# Altium schematic sheet Sheet4.SchDoc
size A4; SheetNumber: 1; SheetTotal: 3
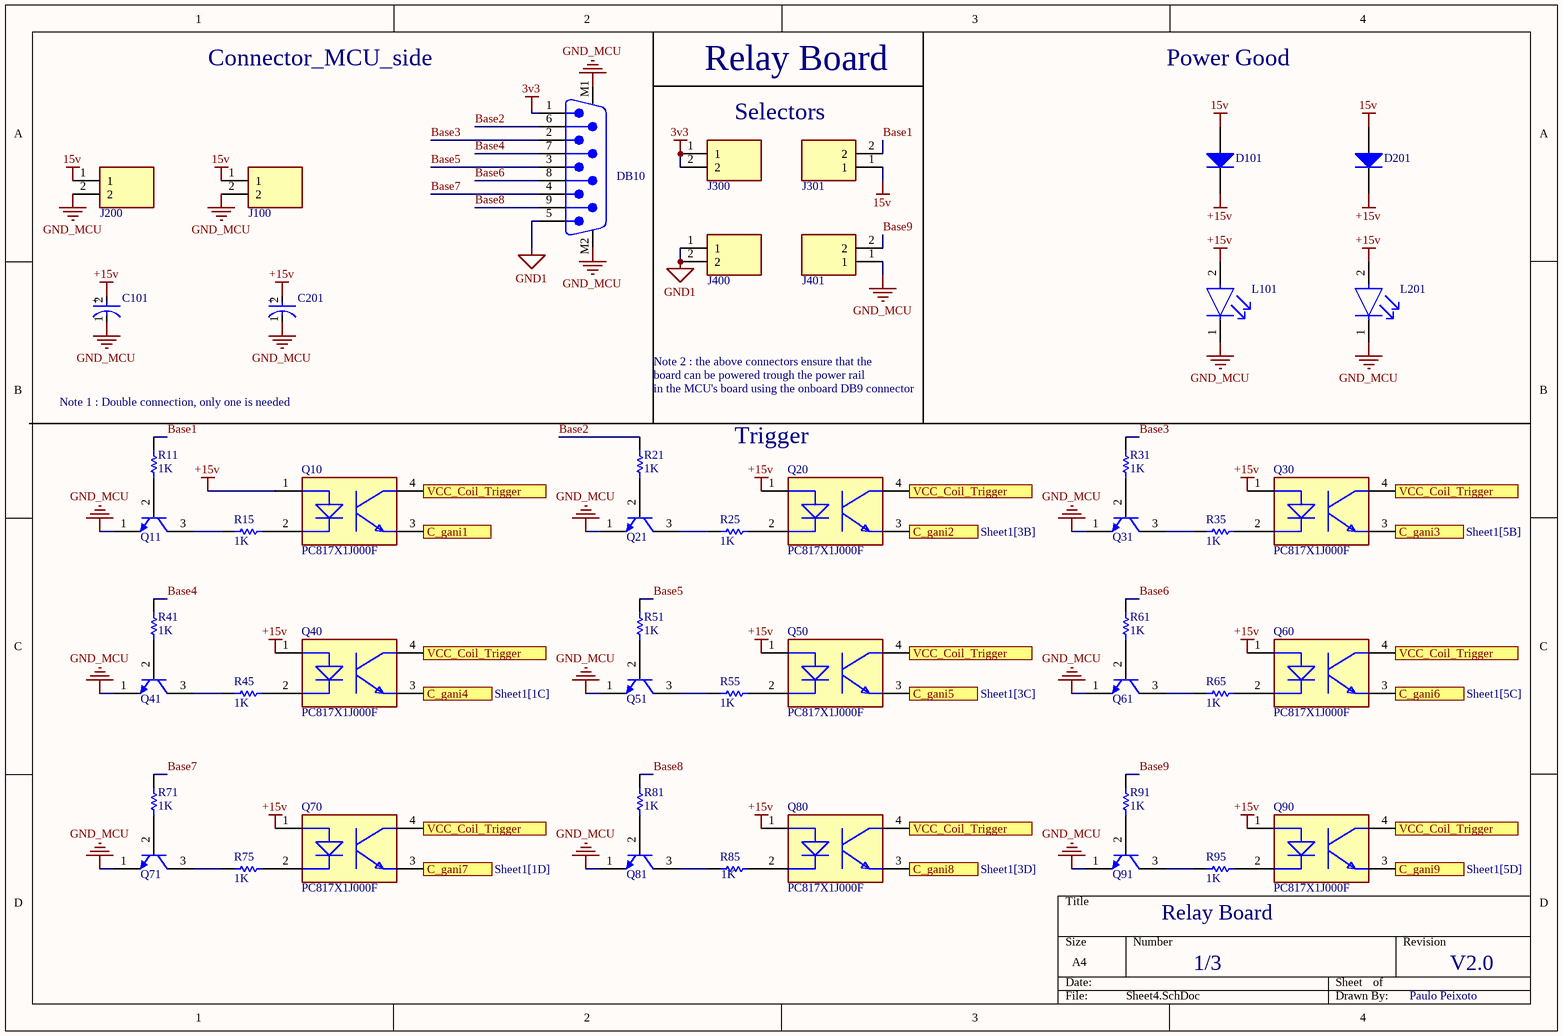
[diagram p0: Sheet4.SchDoc]

## Parts
C101  EEE-FK1H100UR  [FP-FKC-MFG]  (value not drawn)
C201  EEE-FK1H100UR  [FP-FKC-MFG]  (value not drawn)
D101  1N4001-T  [DIOD-DO-41-P-2_V]  (value not drawn)
D201  1N4001-T  [DIOD-DO-41-P-2_V]  (value not drawn)
DB10  618009231221  [618009231221]  (value not drawn)
J100  TB004-508-02BE  [Terminal_TH_2P_3.50]  (value not drawn)
J200  TB004-508-02BE  [Terminal_TH_2P_3.50]  (value not drawn)
J300  TB004-508-02BE  [HEADER_MALE_TH_2P_2.54]  (value not drawn)
J301  TB004-508-02BE  [HEADER_MALE_TH_2P_2.54]  (value not drawn)
J400  TB004-508-02BE  [HEADER_MALE_TH_2P_2.54]  (value not drawn)
J401  TB004-508-02BE  [HEADER_MALE_TH_2P_2.54]  (value not drawn)
L101  TLLG4400  [FP-6_544-5255_01-4-MFG]  (value not drawn)
L201  TLLG4400  [FP-6_544-5255_01-4-MFG]  (value not drawn)
Q10  PC817X1J000F  [FP-PC817X1J000F-MFG]
Q11  PN2222ATF  [FAIR-TO-92-3]  (value not drawn)
Q20  PC817X1J000F  [FP-PC817X1J000F-MFG]
Q21  PN2222ATF  [FAIR-TO-92-3]  (value not drawn)
Q30  PC817X1J000F  [FP-PC817X1J000F-MFG]
Q31  PN2222ATF  [FAIR-TO-92-3]  (value not drawn)
Q40  PC817X1J000F  [FP-PC817X1J000F-MFG]
Q41  PN2222ATF  [FAIR-TO-92-3]  (value not drawn)
Q50  PC817X1J000F  [FP-PC817X1J000F-MFG]
Q51  PN2222ATF  [FAIR-TO-92-3]  (value not drawn)
Q60  PC817X1J000F  [FP-PC817X1J000F-MFG]
Q61  PN2222ATF  [FAIR-TO-92-3]  (value not drawn)
Q70  PC817X1J000F  [FP-PC817X1J000F-MFG]
Q71  PN2222ATF  [FAIR-TO-92-3]  (value not drawn)
Q80  PC817X1J000F  [FP-PC817X1J000F-MFG]
Q81  PN2222ATF  [FAIR-TO-92-3]  (value not drawn)
Q90  PC817X1J000F  [FP-PC817X1J000F-MFG]
Q91  PN2222ATF  [FAIR-TO-92-3]  (value not drawn)
R11  1K  [RESC3216X70X50NL05T20]
R15  1K  [RESC3216X70X50NL05T20]
R21  1K  [RESC3216X70X50NL05T20]
R25  1K  [RESC3216X70X50NL05T20]
R31  1K  [RESC3216X70X50NL05T20]
R35  1K  [RESC3216X70X50NL05T20]
R41  1K  [RESC3216X70X50NL05T20]
R45  1K  [RESC3216X70X50NL05T20]
R51  1K  [RESC3216X70X50NL05T20]
R55  1K  [RESC3216X70X50NL05T20]
R61  1K  [RESC3216X70X50NL05T20]
R65  1K  [RESC3216X70X50NL05T20]
R71  1K  [RESC3216X70X50NL05T20]
R75  1K  [RESC3216X70X50NL05T20]
R81  1K  [RESC3216X70X50NL05T20]
R85  1K  [RESC3216X70X50NL05T20]
R91  1K  [RESC3216X70X50NL05T20]
R95  1K  [RESC3216X70X50NL05T20]

## Ports
C_gani1 (see Sheet1[1B]), C_gani2 (see Sheet1[3B]), C_gani3 (see Sheet1[5B]), C_gani4 (see Sheet1[1C]), C_gani5 (see Sheet1[3C]), C_gani6 (see Sheet1[5C]), C_gani7 (see Sheet1[1D]), C_gani8 (see Sheet1[3D]), C_gani9 (see Sheet1[5D]), VCC_Coil_Trigger (see Sheet1[1A], Sheet1[1C], Sheet1[1D], Sheet1[3A], Sheet1[3C], Sheet1[3D], Sheet1[5A], Sheet1[5C], Sheet1[5D], Sheet2[1A], Sheet2[2A], Sheet4[2B], Sheet4[2C], Sheet4[2D], Sheet4[3B], Sheet4[3C], Sheet4[3D], Sheet4[4B], Sheet4[4C]), VCC_Coil_Trigger (see Sheet1[1A], Sheet1[1C], Sheet1[1D], Sheet1[3A], Sheet1[3C], Sheet1[3D], Sheet1[5A], Sheet1[5C], Sheet1[5D], Sheet2[1A], Sheet2[2A], Sheet4[2B], Sheet4[2C], Sheet4[2D], Sheet4[3B], Sheet4[3C], Sheet4[3D], Sheet4[4B], Sheet4[4D]), VCC_Coil_Trigger (see Sheet1[1A], Sheet1[1C], Sheet1[1D], Sheet1[3A], Sheet1[3C], Sheet1[3D], Sheet1[5A], Sheet1[5C], Sheet1[5D], Sheet2[1A], Sheet2[2A], Sheet4[2B], Sheet4[2C], Sheet4[2D], Sheet4[3B], Sheet4[3C], Sheet4[3D], Sheet4[4C], Sheet4[4D]), VCC_Coil_Trigger (see Sheet1[1A], Sheet1[1C], Sheet1[1D], Sheet1[3A], Sheet1[3C], Sheet1[3D], Sheet1[5A], Sheet1[5C], Sheet1[5D], Sheet2[1A], Sheet2[2A], Sheet4[2B], Sheet4[2C], Sheet4[2D], Sheet4[3B], Sheet4[3C], Sheet4[4B], Sheet4[4C], Sheet4[4D]), VCC_Coil_Trigger (see Sheet1[1A], Sheet1[1C], Sheet1[1D], Sheet1[3A], Sheet1[3C], Sheet1[3D], Sheet1[5A], Sheet1[5C], Sheet1[5D], Sheet2[1A], Sheet2[2A], Sheet4[2B], Sheet4[2C], Sheet4[2D], Sheet4[3B], Sheet4[3D], Sheet4[4B], Sheet4[4C], Sheet4[4D]), VCC_Coil_Trigger (see Sheet1[1A], Sheet1[1C], Sheet1[1D], Sheet1[3A], Sheet1[3C], Sheet1[3D], Sheet1[5A], Sheet1[5C], Sheet1[5D], Sheet2[1A], Sheet2[2A], Sheet4[2B], Sheet4[2C], Sheet4[2D], Sheet4[3C], Sheet4[3D], Sheet4[4B], Sheet4[4C], Sheet4[4D]), VCC_Coil_Trigger (see Sheet1[1A], Sheet1[1C], Sheet1[1D], Sheet1[3A], Sheet1[3C], Sheet1[3D], Sheet1[5A], Sheet1[5C], Sheet1[5D], Sheet2[1A], Sheet2[2A], Sheet4[2B], Sheet4[2C], Sheet4[3B], Sheet4[3C], Sheet4[3D], Sheet4[4B], Sheet4[4C], Sheet4[4D]), VCC_Coil_Trigger (see Sheet1[1A], Sheet1[1C], Sheet1[1D], Sheet1[3A], Sheet1[3C], Sheet1[3D], Sheet1[5A], Sheet1[5C], Sheet1[5D], Sheet2[1A], Sheet2[2A], Sheet4[2B], Sheet4[2D], Sheet4[3B], Sheet4[3C], Sheet4[3D], Sheet4[4B], Sheet4[4C], Sheet4[4D]), VCC_Coil_Trigger (see Sheet1[1A], Sheet1[1C], Sheet1[1D], Sheet1[3A], Sheet1[3C], Sheet1[3D], Sheet1[5A], Sheet1[5C], Sheet1[5D], Sheet2[1A], Sheet2[2A], Sheet4[2C], Sheet4[2D], Sheet4[3B], Sheet4[3C], Sheet4[3D], Sheet4[4B], Sheet4[4C], Sheet4[4D])

## Nets
3v3: DB10.1 J300.1 J300.2
15v: D101.1(A) D201.1(A) J100.1 J200.1 J301.1
+15v: C101.2(A) C201.2(A) D101.2(K) D201.2(K) L101.2(A) L201.2(A) Q10.1(A) Q20.1(A) Q30.1(A) Q40.1(A) Q50.1(A) Q60.1(A) Q70.1(A) Q80.1(A) Q90.1(A)
GND1: DB10.5 J400.1 J400.2
GND_MCU: C101.1(C) C201.1(C) DB10.M1 DB10.M2 J100.2 J200.2 J401.1 L101.1(C) L201.1(C) Q11.1(E) Q21.1(E) Q31.1(E) Q41.1(E) Q51.1(E) Q61.1(E) Q71.1(E) Q81.1(E) Q91.1(E)
Base1: J301.2 R11.2
Base2: DB10.6 R21.2
Base3: DB10.2 R31.2
Base4: DB10.7 R41.2
Base5: DB10.3 R51.2
Base6: DB10.8 R61.2
Base7: DB10.4 R71.2
Base8: DB10.9 R81.2
Base9: J401.2 R91.2
C_gani1: Q10.3(E) ; port C_gani1
C_gani2: Q20.3(E) ; port C_gani2
C_gani3: Q30.3(E) ; port C_gani3
C_gani4: Q40.3(E) ; port C_gani4
C_gani5: Q50.3(E) ; port C_gani5
C_gani6: Q60.3(E) ; port C_gani6
C_gani7: Q70.3(E) ; port C_gani7
C_gani8: Q80.3(E) ; port C_gani8
C_gani9: Q90.3(E) ; port C_gani9
VCC_Coil_Trigger: Q10.4(C) Q20.4(C) Q30.4(C) Q40.4(C) Q50.4(C) Q60.4(C) Q70.4(C) Q80.4(C) Q90.4(C) ; port VCC_Coil_Trigger
NetQ10_2: Q10.2(C) R15.1
NetQ11_2: Q11.2(B) R11.1
NetQ11_3: Q11.3(C) R15.2
NetQ20_2: Q20.2(C) R25.1
NetQ21_2: Q21.2(B) R21.1
NetQ21_3: Q21.3(C) R25.2
NetQ30_2: Q30.2(C) R35.1
NetQ31_2: Q31.2(B) R31.1
NetQ31_3: Q31.3(C) R35.2
NetQ40_2: Q40.2(C) R45.1
NetQ41_2: Q41.2(B) R41.1
NetQ41_3: Q41.3(C) R45.2
NetQ50_2: Q50.2(C) R55.1
NetQ51_2: Q51.2(B) R51.1
NetQ51_3: Q51.3(C) R55.2
NetQ60_2: Q60.2(C) R65.1
NetQ61_2: Q61.2(B) R61.1
NetQ61_3: Q61.3(C) R65.2
NetQ70_2: Q70.2(C) R75.1
NetQ71_2: Q71.2(B) R71.1
NetQ71_3: Q71.3(C) R75.2
NetQ80_2: Q80.2(C) R85.1
NetQ81_2: Q81.2(B) R81.1
NetQ81_3: Q81.3(C) R85.2
NetQ90_2: Q90.2(C) R95.1
NetQ91_2: Q91.2(B) R91.1
NetQ91_3: Q91.3(C) R95.2

## Notes on the sheet
- Connector_MCU_side
- Relay Board
- Power Good
- Selectors
- Note 2 : the above connectors ensure that the
- board can be powered trough the power rail
- (near R11) Note 1 : Double connection, only one is needed
- in the MCU's board using the onboard DB9 connector
- (near Q20) Trigger
- 1/3
- V2.0
- Paulo Peixoto
- (in symbol CMP-05427-000030-1) +

## Library data of the parts
C101 C201 = CMP-05427-000030-1: CAP ALUM 10UF 20% 50V SMD; Impedance: 1.52R; Ripple Current (AC): 85mA; Life (Hours): 2000Hour; Leakage Current: 3uA; Dielectric Material: Aluminium; Length: 5.8mm; Voltage Rating: 50V; Radiation Hardening: No; Max Operating Temperature: 105°C; REACH SVHC: No SVHC; Tolerance: 20%; RoHS Compliant: Yes; Case/Package: Radial; Height: 5.8mm; Voltage: 50V; Diameter: 5mm; Number of Pins: 2; Ripple Current: 85mA; Series: FK; Lead Free: Lead Free; Width: 6.5mm; ESR (Equivalent Series Resistance): 1.52R; Package Quantity: 1000; Construction: Cylindrical; Voltage Rating (DC): 50V; Packaging: Tape and Reel; Height - Seated (Max): 0.228inch; Contact Plating: Tin; Capacitance: 10uF; Min Operating Temperature: -55°C; Termination: SMD/SMT; Material: Aluminium; Mount: Surface Mount
D101 D201 = CMP-0639-00006-2: 1.0 A Rectifier, 15 pF, 50 V, -65 to 150 degC, 2-Pin DO-41 Plastic, RoHS, Tape and Reel; Manufacturer: Diodes Inc; VF (V): 1; CT (pF): 15; Max. IR (uA): 5; VRRM (V): 50; Max. IFSM (A): 30; RoHS: TRUE; Mounting Technology: Through Hole; PartNumber: 1N4001-T; ComponentLink2Description: Datasheet; DatasheetVersion: Rev. 8-2; Operating Temperature Range (degC): -65 to 150; Packing: Tape and Reel; PackageReference: DO-41-P-2; ComponentLink1URL: http://diodes.com/; PackageDescription: 2-Pin Axial Lead, Body 4.635 x 2.36 mm, Lead Spread 25.4 mm; ComponentLink2URL: http://diodes.com/datasheets/ds28002.pdf; Max. Average Rectified Current IO (A): 1; ComponentLink1Description: Manufacturer URL
DB10 = CMP-1502-00284-2: NexarPartId: 22865742; Pitch: 2.77mm; Number of Contacts: 9; Operating Supply Voltage: 125V; Insulation Resistance: 5GΩ; Gender: Male; Contact Resistance: 30mΩ; Current Rating: 3A; Mount: Through Hole; Housing Material: Steel; Contact Plating: Gold; Width: 12.5mm; Insulation Material: PBT; RoHS: Compliant; Depth: 18.5mm; Contact Material: Gold; Max Operating Temperature: 105°C; Min Operating Temperature: -55°C; Termination: SMD/SMT; Height: 12.7mm; Voltage Rating: 125V; Length: 30.8mm; Orientation: Right Angle; Number of Rows: 2; Number of Pins: 9; REACH SVHC: Unknown
J100 J200 = Con_Terminal_2P: Connector; Manufacturer_Name: CUI Devices; Datasheet Link: https://componentsearchengine.com/Datasheets/1/TB004-508-02BE.pdf; Height: 14.1mm; Manufacturer_Part_Number: TB004-508-02BE; Arrow Part Number: TB004-508-02BE; Arrow Price/Stock: https://www.arrow.com/en/products/tb004-508-02be/cui-inc; Mouser Part Number: 490-TB004-508-02BE; Mouser Price/Stock: https://www.mouser.co.uk/ProductDetail/CUI-Devices/TB004-508-02BE?qs=vLWxofP3U2zLwdGzG2tSkA%3D%3D
J300 J301 J400 J401 = Con_Header_2P: Connector; Manufacturer_Name: CUI Devices; Datasheet Link: https://componentsearchengine.com/Datasheets/1/TB004-508-02BE.pdf; Height: 14.1mm; Manufacturer_Part_Number: TB004-508-02BE; Arrow Part Number: TB004-508-02BE; Arrow Price/Stock: https://www.arrow.com/en/products/tb004-508-02be/cui-inc; Mouser Part Number: 490-TB004-508-02BE; Mouser Price/Stock: https://www.mouser.co.uk/ProductDetail/CUI-Devices/TB004-508-02BE?qs=vLWxofP3U2zLwdGzG2tSkA%3D%3D
L101 L201 = CMP-00030-55433990-1: TLLG4400 Led, Pcb, Green, 0.63MCD, 3MM, T-1, 7MA, 1.9V, 565NM, 25DEG, 20V, 20MW, -40; Lens Transparency: Diffused; Dominant Wavelength: 575nm; Test Current: 2mA; Viewing Angle: 50°; Lens Style: Circular, Colored, Diffused, Dome, Round; Number of LEDs: 1; Voltage Rating (DC): 2.4V; Luminous Intensity: 1.2mcd; Depth: 3.2mm; Wavelength: 575nm; Color: Green; Schedule B: 8541402000, 8541402000; RoHS: Compliant; Max Operating Temperature: 100°C; Power Dissipation: 20mW; Height: 4.5mm; Number of Pins: 2; Forward Voltage: 1.9V; NexarPartId: 55433990; Max Power Dissipation: 20mW; Length: 3.2mm; Forward Current: 2mA; Min Operating Temperature: -40°C; Illumination Color: Green; Lens Size: 3mm; Reverse Voltage: 20V; Mount: Through Hole; Case/Package: T; Radiation Hardening: No; Number of Elements: 1; REACH SVHC: Unknown; Lens Color: Green
Q10 Q20 Q30 Q40 Q50 Q60 Q70 Q80 Q90 = CMP-65434-000003-1: OPTOISOLATOR 5KV TRANS 4DIP; Collector Emitter Saturation Voltage: 200mV; Forward Voltage: 1.4V; Power Dissipation: 200mW; Input Current: 20mA; Max Collector Current: 50mA; Collector Emitter Breakdown Voltage: 80V; Rise Time: 18000ns; Number of Elements: 1; Reverse Breakdown Voltage: 6V; Current Transfer Ratio: 600%; Min Operating Temperature: -30°C; Number of Pins: 4; Radiation Hardening: No; Output Current per Channel: 50mA; Case/Package: DIP; Fall Time: 18000ns; Forward Current: 50mA; Isolation Voltage: 5kV; Package Quantity: 2000; Max Operating Temperature: 100°C; Packaging: Sleeve; Max Input Current: 50mA; Output Voltage: 80V; Max Power Dissipation: 200mW; Mount: Through Hole; Number of Channels: 1; Collector Emitter Voltage (VCEO): 80V
Q11 Q21 Q31 Q41 Q51 Q61 Q71 Q81 Q91 = CMP-2000-06911-1: NPN General-Purpose Amplifier, 40 V, -55 to 150 degC, 3-Pin TO-92, RoHS, Tape and Reel; Manufacturer: FairchildSemiconductor; Configuration: Single; Collector-Emitter Saturation Voltage: 1V; Collector- Emitter Voltage VCEO Max: 40V; Unit Weight: 0.008466oz; Maximum DC Collector Current: 1A; DC Collector/Base Gain hfe Min: 100; Emitter- Base Voltage VEBO: 6V; Maximum Power Dissipation: 625mW; DC Current Gain hFE Max: 300; Gain Bandwidth Product fT: 300MHz; Collector- Base Voltage VCBO: 75V; Mounting Style: ThroughHole; Package Description: 3-Pin Transistor Outline Package, Body Dia 4.79 mm, Pitch 2.6 mm; Mounting Technology: ThroughHole; RoHS: Details; Brand: FairchildSemiconductor; Minimum Operating Temperature: -55C; Package / Case: TO-92-3KinkedLead; Package Reference: TO-92; Series: PN2222; Packaging: Reel; Datasheet Version: Rev. 1.1.0, 07/2014; Datasheet URL: https://www.fairchildsemi.com/datasheets/PN/PN2222A.pdf; Maximum Operating Temperature: +150C; Transistor Polarity: NPN; Factory Pack Quantity: 2000; Manufacturer URL: https://www.fairchildsemi.com/; <PCN>: http://www.mouser.com/PCN/3.26.10LTBDFairchild.pdf; Product Category: BipolarTransistors-BJT
R11 R15 R21 R25 R31 R35 R41 R45 R51 R55 R61 R65 R71 R75 R81 R85 R91 R95 = CMP-2003-00541-1: Manufacturer: Panasonic; Part Number: ERJ-8GEY0R00V